# Altium schematic sheet Extension.SchDoc
size A4; Revision: B.1(PCB.SCH)
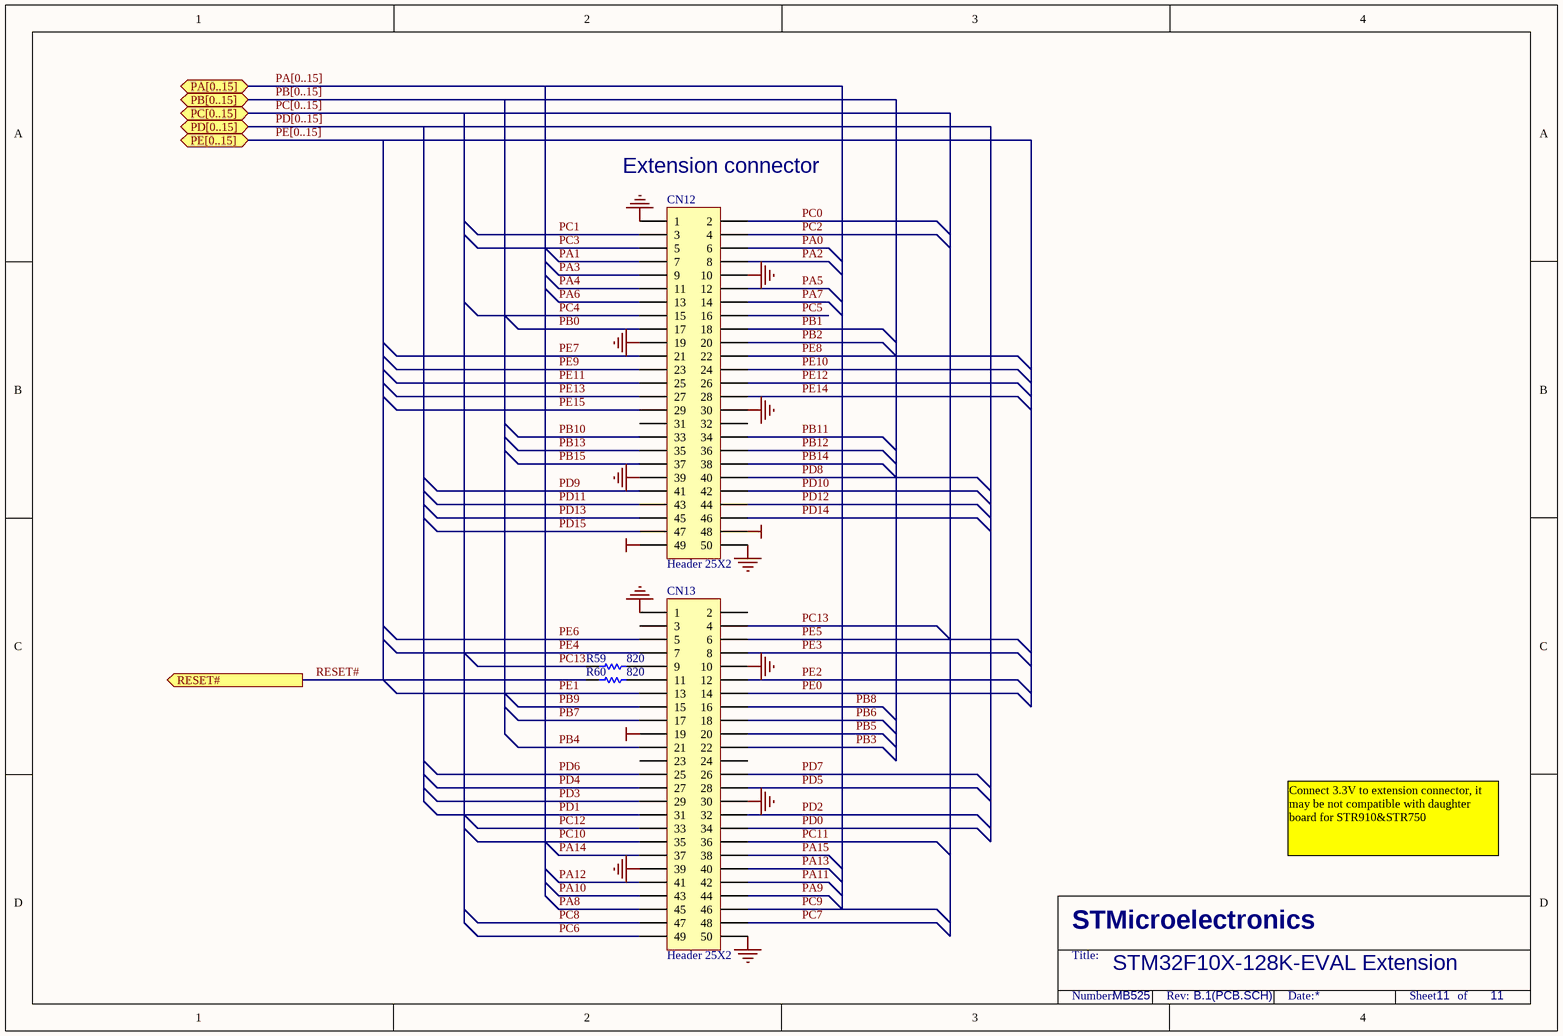
[diagram p0: Extension.SchDoc]

## Parts
CN12  Header 25X2  [2*25P]
CN13  Header 25X2  [2*25P]
R59  820  [0603]
R60  820  [0603]

## Ports
PA[0..15] (bidir), PB[0..15] (bidir), PC[0..15] (bidir), PD[0..15] (bidir), PE[0..15] (bidir), RESET# (out)

## Nets
+3V3: CN12.48
D5V: CN12.49 CN13.19
GND: CN12.1 CN12.10 CN12.19 CN12.30 CN12.39 CN12.50 CN13.1 CN13.10 CN13.30 CN13.39 CN13.50
PA0: CN12.6
PA1: CN12.7
PA2: CN12.8
PA3: CN12.9
PA4: CN12.11
PA5: CN12.12
PA6: CN12.13
PA7: CN12.14
PA8: CN13.45
PA9: CN13.44
PA10: CN13.43
PA11: CN13.42
PA12: CN13.41
PA13: CN13.40
PA14: CN13.37
PA15: CN13.38
PB0: CN12.17
PB1: CN12.18
PB2: CN12.20
PB3: CN13.22
PB4: CN13.21
PB5: CN13.20
PB6: CN13.18
PB7: CN13.17
PB8: CN13.16
PB9: CN13.15
PB10: CN12.33
PB11: CN12.34
PB12: CN12.36
PB13: CN12.35
PB14: CN12.38
PB15: CN12.37
PC0: CN12.2
PC1: CN12.3
PC2: CN12.4
PC3: CN12.5
PC4: CN12.15
PC5: CN12.16
PC6: CN13.49
PC7: CN13.48
PC8: CN13.47
PC9: CN13.46
PC10: CN13.35
PC11: CN13.36
PC12: CN13.33
PC13: CN13.4 R59.1
PD0: CN13.34
PD1: CN13.31
PD2: CN13.32
PD3: CN13.29
PD4: CN13.27
PD5: CN13.28
PD6: CN13.25
PD7: CN13.26
PD8: CN12.40
PD9: CN12.41
PD10: CN12.42
PD11: CN12.43
PD12: CN12.44
PD13: CN12.45
PD14: CN12.46
PD15: CN12.47
PE0: CN13.14
PE1: CN13.13
PE2: CN13.12
PE3: CN13.8
PE4: CN13.7
PE5: CN13.6
PE6: CN13.5
PE7: CN12.21
PE8: CN12.22
PE9: CN12.23
PE10: CN12.24
PE11: CN12.25
PE12: CN12.26
PE13: CN12.27
PE14: CN12.28
PE15: CN12.29
RESET#: R60.2 ; port RESET#
NetCN13_9: CN13.9 R59.2
NetCN13_11: CN13.11 R60.1

Not connected (* = marked no-connect by the designer): CN12 31 32; CN13 2 3 23 24

## Buses and harness runs
bus PA[0..15] = port PA[0..15]
bus PB[0..15] = port PB[0..15]
bus PC[0..15] = port PC[0..15]
bus PD[0..15] = port PD[0..15]
bus PE[0..15] = port PE[0..15]

## Notes on the sheet
- (near CN12) Extension connector
- Connect 3.3V to extension connector, it may be not compatible with daughter board for STR910&STR750
- STM32F10X-128K-EVAL Extension
- MB525
- 11
- STMicroelectronics
- Title:
- Number:
- Rev:
- Date:
- Sheet       of

## Library data of the parts
CN12 CN13 = Header 25X2: Header, 25-Pin, Dual row; Revision: 17-Jul-2002: Re-released for DXP Platform.; Publisher: Altium Limited
R59 R60 = Res1: Resistor; Value: 1K; Published: 8-Jun-2000; Revision: July-2002: Re-released for DXP Platform.; Publisher: Altium Limited